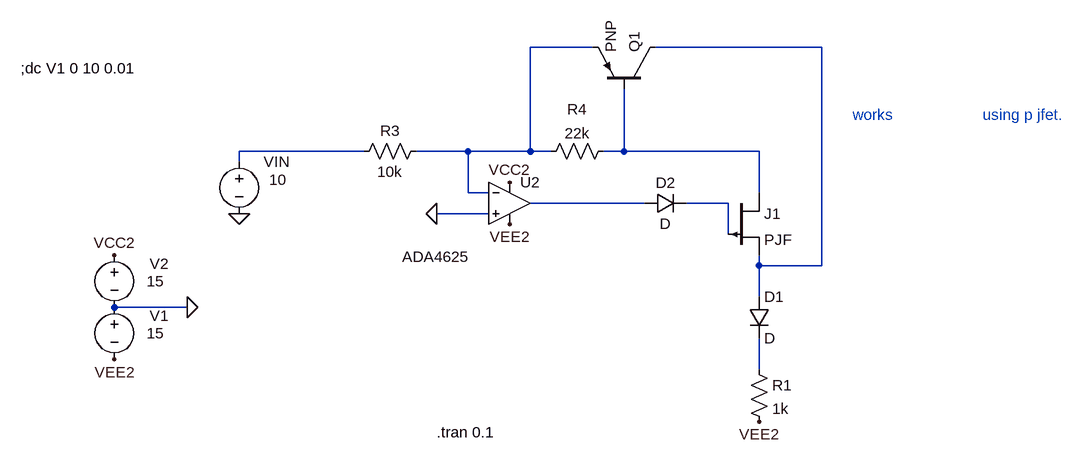
[diagram p0: schematic Draft15.asc]
Draft15.asc, the LTspice schematic file:
Version 4
SHEET 1 1768 680
WIRE 544 -144 448 -144
WIRE 896 -144 640 -144
WIRE 192 16 0 16
WIRE 352 16 272 16
WIRE 448 16 448 -144
WIRE 448 16 352 16
WIRE 480 16 448 16
WIRE 592 16 592 -80
WIRE 592 16 560 16
WIRE 800 16 592 16
WIRE 0 32 0 16
WIRE 352 80 352 16
WIRE 384 80 352 80
WIRE 800 80 800 16
WIRE 624 96 448 96
WIRE 752 96 688 96
WIRE 384 112 304 112
WIRE 752 144 752 96
WIRE 800 192 800 176
WIRE 896 192 896 -144
WIRE 896 192 800 192
WIRE 800 240 800 192
WIRE -80 256 -192 256
WIRE 800 352 800 304
FLAG -80 256 0
FLAG -192 336 VEE2
FLAG -192 176 VCC2
FLAG 416 128 VEE2
FLAG 416 64 VCC2
FLAG 0 112 0
FLAG 304 112 0
FLAG 800 432 VEE2
SYMBOL voltage 0 16 R0
WINDOW 123 0 0 Left 0
WINDOW 39 0 0 Left 0
WINDOW 3 46 44 Left 2
WINDOW 0 38 16 Left 2
SYMATTR Value 10
SYMATTR InstName VIN
SYMBOL voltage -192 240 R0
WINDOW 0 54 29 Left 2
WINDOW 3 50 56 Left 2
WINDOW 123 0 0 Left 0
WINDOW 39 0 0 Left 0
SYMATTR InstName V1
SYMATTR Value 15
SYMBOL res 784 336 R0
SYMATTR InstName R1
SYMATTR Value 1k
SYMBOL res 288 0 R90
WINDOW 0 0 56 VBottom 2
WINDOW 3 32 56 VTop 2
SYMATTR InstName R3
SYMATTR Value 10k
SYMBOL voltage -192 160 R0
WINDOW 0 54 29 Left 2
WINDOW 3 50 56 Left 2
WINDOW 123 0 0 Left 0
WINDOW 39 0 0 Left 0
SYMATTR InstName V2
SYMATTR Value 15
SYMBOL res 576 0 R90
WINDOW 0 -33 56 VBottom 2
WINDOW 3 -27 56 VTop 2
SYMATTR InstName R4
SYMATTR Value 22k
SYMBOL pnp 640 -80 M270
SYMATTR InstName Q1
SYMBOL OpAmps\\ADA4625 416 32 R0
WINDOW 3 -165 146 Left 2
SYMATTR InstName U2
SYMBOL diode 784 240 R0
SYMATTR InstName D1
SYMBOL diode 624 112 R270
WINDOW 0 32 32 VTop 2
WINDOW 3 0 32 VBottom 2
SYMATTR InstName D2
SYMBOL pjf 752 80 R0
SYMATTR InstName J1
TEXT -336 -112 Left 2 !;dc V1 0 10 0.01
TEXT 304 448 Left 2 !.tran 0.1
TEXT 944 -40 Left 2 ;works
TEXT 1144 -40 Left 2 ;using p jfet.

The netlist it stands for:
* Draft15.asc
VIN N003 0 10
V1 0 VEE2 15
R1 N007 VEE2 1k
R3 N001 N003 10k
V2 VCC2 0 15
R4 N004 N001 22k
Q1 N002 N004 N001 0 PNP
XU2 0 N001 VCC2 VEE2 N005 ADA4625  ; pins In+ In- V+ V- OUT
D1 N002 N007 D
D2 N005 N006 D
J1 N004 N006 N002 PJF
.model D D
.lib standard.dio
.model NPN NPN
.model PNP PNP
.lib standard.bjt
.model NJF NJF
.model PJF PJF
.lib standard.jft
;dc V1 0 10 0.01
.tran 0.1
* works
* using p jfet.
.backanno
.end